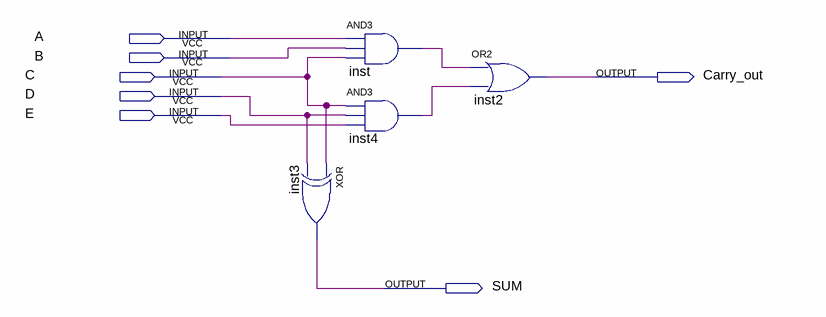
[diagram p0: schematic sheet]
// Quartus schematic HAS.bdf as structural Verilog: 4 symbols, 7 pins
module HAS (
  input  A,
  input  B,
  input  C,
  input  D,
  input  E,
  output Carry_out,
  output SUM
);

  wire inst4_out, inst_out;

  xor inst3 (SUM, C, D);
  and inst (inst_out, A, B, C);
  and inst4 (inst4_out, C, D, E);
  or inst2 (Carry_out, inst_out, inst4_out);
endmodule
